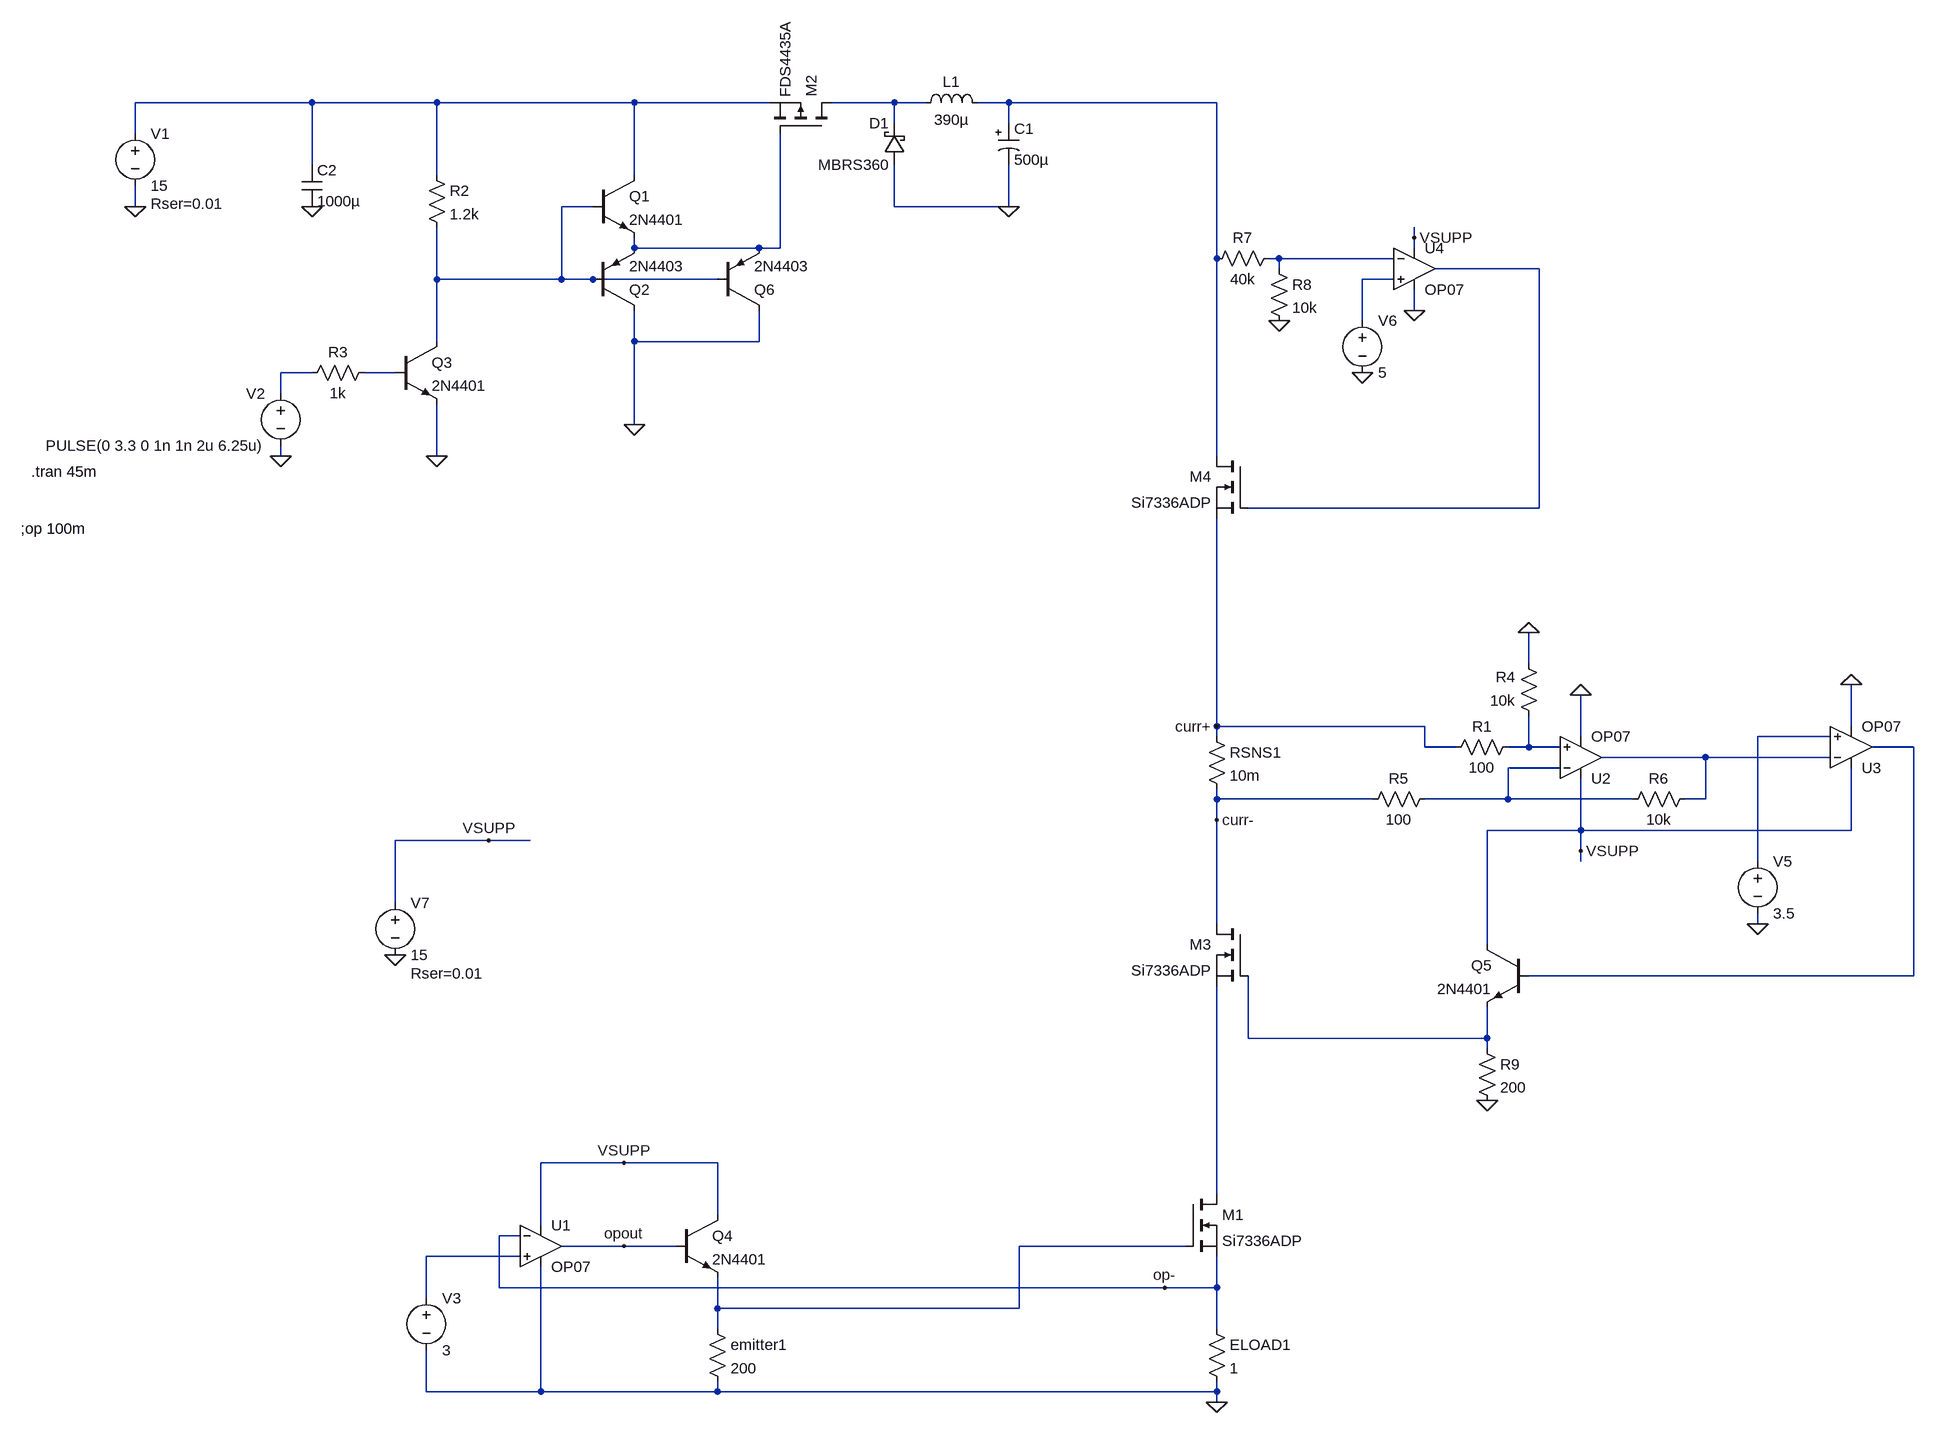
[diagram p0: schematic EloadSimWithBuck.asc]
EloadSimWithBuck.asc, the LTspice schematic file:
Version 4
SHEET 1 1988 2104
WIRE -480 64 -752 64
WIRE -288 64 -480 64
WIRE 16 64 -288 64
WIRE 224 64 16 64
WIRE 416 64 320 64
WIRE 464 64 416 64
WIRE 592 64 544 64
WIRE 912 64 592 64
WIRE 416 96 416 64
WIRE 592 96 592 64
WIRE -752 112 -752 64
WIRE -480 160 -480 64
WIRE -288 176 -288 64
WIRE 16 176 16 64
WIRE -752 224 -752 192
WIRE -48 224 -96 224
WIRE 416 224 416 160
WIRE 592 224 592 160
WIRE 592 224 416 224
WIRE 1216 272 1216 256
WIRE 16 288 16 272
WIRE 208 288 16 288
WIRE 240 288 240 112
WIRE 240 288 208 288
WIRE 1216 288 1216 272
WIRE 912 304 912 64
WIRE 1008 304 992 304
WIRE 1184 304 1008 304
WIRE 1008 320 1008 304
WIRE 1408 320 1248 320
WIRE -288 336 -288 256
WIRE -96 336 -96 224
WIRE -96 336 -288 336
WIRE -48 336 -96 336
WIRE 144 336 -48 336
WIRE 1184 336 1136 336
WIRE 1216 384 1216 352
WIRE 1136 400 1136 336
WIRE -288 432 -288 336
WIRE 16 432 16 384
WIRE 208 432 208 384
WIRE 208 432 16 432
WIRE -480 480 -528 480
WIRE -352 480 -400 480
WIRE -528 512 -528 480
WIRE 16 560 16 432
WIRE -528 608 -528 592
WIRE -288 608 -288 528
WIRE 912 608 912 304
WIRE 1408 688 1408 320
WIRE 1408 688 960 688
WIRE 1392 928 1392 880
WIRE 912 1024 912 704
WIRE 1232 1024 912 1024
WIRE 1888 1024 1888 960
WIRE 912 1040 912 1024
WIRE 1472 1040 1472 976
WIRE 1856 1040 1744 1040
WIRE 1232 1056 1232 1024
WIRE 1280 1056 1232 1056
WIRE 1392 1056 1392 1008
WIRE 1392 1056 1360 1056
WIRE 1440 1056 1392 1056
WIRE 1984 1056 1920 1056
WIRE 1664 1072 1504 1072
WIRE 1856 1072 1664 1072
WIRE 1440 1088 1360 1088
WIRE 912 1136 912 1120
WIRE 1152 1136 912 1136
WIRE 1360 1136 1360 1088
WIRE 1360 1136 1232 1136
WIRE 1552 1136 1360 1136
WIRE 1664 1136 1664 1072
WIRE 1664 1136 1632 1136
WIRE 912 1168 912 1136
WIRE 1472 1184 1472 1104
WIRE 1472 1184 1328 1184
WIRE 1888 1184 1888 1088
WIRE 1888 1184 1472 1184
WIRE -208 1200 -352 1200
WIRE -144 1200 -208 1200
WIRE 1472 1216 1472 1184
WIRE 1472 1232 1472 1216
WIRE 1744 1232 1744 1040
WIRE -352 1296 -352 1200
WIRE 912 1328 912 1168
WIRE 1744 1328 1744 1312
WIRE 1328 1360 1328 1184
WIRE 1984 1408 1984 1056
WIRE 1984 1408 1392 1408
WIRE 960 1504 960 1408
WIRE 1328 1504 1328 1456
WIRE 1328 1504 960 1504
WIRE 1328 1520 1328 1504
WIRE 0 1696 -128 1696
WIRE 144 1696 0 1696
WIRE 912 1744 912 1424
WIRE 144 1776 144 1696
WIRE -128 1792 -128 1696
WIRE -160 1808 -192 1808
WIRE 0 1824 -96 1824
WIRE 80 1824 0 1824
WIRE 864 1824 608 1824
WIRE -160 1840 -304 1840
WIRE -192 1888 -192 1808
WIRE 832 1888 -192 1888
WIRE 912 1888 912 1840
WIRE 912 1888 832 1888
WIRE -304 1904 -304 1840
WIRE 144 1920 144 1872
WIRE 608 1920 608 1824
WIRE 608 1920 144 1920
WIRE 144 1952 144 1920
WIRE 912 1952 912 1888
WIRE -304 2048 -304 1984
WIRE -128 2048 -128 1856
WIRE -128 2048 -304 2048
WIRE 144 2048 144 2032
WIRE 144 2048 -128 2048
WIRE 912 2048 912 2032
WIRE 912 2048 144 2048
WIRE 912 2064 912 2048
FLAG -528 608 0
FLAG -752 224 0
FLAG -288 608 0
FLAG 16 560 0
FLAG 912 2064 0
FLAG 0 1824 opout
FLAG 832 1888 op-
FLAG 912 1024 curr+
FLAG 912 1168 curr-
FLAG 1744 1328 0
FLAG 1392 880 0
FLAG 1472 976 0
FLAG 1888 960 0
FLAG 1008 400 0
FLAG 1216 384 0
FLAG 1136 480 0
FLAG 1328 1600 0
FLAG -352 1376 0
FLAG -208 1200 VSUPP
FLAG 0 1696 VSUPP
FLAG 1472 1216 VSUPP
FLAG 1216 272 VSUPP
FLAG 592 224 0
FLAG -480 224 0
DATAFLAG 1408 608 ""
DATAFLAG 480 1920 ""
DATAFLAG 528 1888 ""
DATAFLAG 784 64 ""
DATAFLAG 912 208 ""
DATAFLAG 912 816 ""
DATAFLAG 1744 1408 ""
DATAFLAG 1120 1520 ""
DATAFLAG 1184 1504 ""
SYMBOL schottky 432 160 R180
WINDOW 0 24 64 Left 2
WINDOW 3 24 0 Left 2
SYMATTR InstName D1
SYMATTR Value MBRS360
SYMATTR Description Diode
SYMATTR Type diode
SYMBOL ind 448 80 R270
WINDOW 0 32 56 VTop 2
WINDOW 3 5 56 VBottom 2
SYMATTR InstName L1
SYMATTR Value 390µ
SYMATTR SpiceLine Rser=72m
SYMBOL voltage -752 96 R0
WINDOW 123 0 0 Left 0
WINDOW 39 24 124 Left 2
SYMATTR SpiceLine Rser=0.01
SYMATTR InstName V1
SYMATTR Value 15
SYMBOL voltage -528 496 M0
WINDOW 123 0 0 Left 0
WINDOW 39 0 0 Left 0
SYMATTR InstName V2
SYMATTR Value PULSE(0 3.3 0 1n 1n 2u 6.25u)
SYMBOL res -304 160 R0
SYMATTR InstName R2
SYMATTR Value 1.2k
SYMBOL res -384 464 R90
WINDOW 0 0 56 VBottom 2
WINDOW 3 32 56 VTop 2
SYMATTR InstName R3
SYMATTR Value 1k
SYMBOL npn -352 432 R0
SYMATTR InstName Q3
SYMATTR Value 2N4401
SYMBOL npn -48 176 R0
SYMATTR InstName Q1
SYMATTR Value 2N4401
SYMBOL pnp -48 384 M180
SYMATTR InstName Q2
SYMATTR Value 2N4403
SYMBOL pmos 320 112 M270
SYMATTR InstName M2
SYMATTR Value FDS4435A
SYMBOL polcap 576 96 R0
SYMATTR InstName C1
SYMATTR Value 500µ
SYMATTR SpiceLine Rser=74m
SYMBOL OpAmps\\OP07 -128 1760 R0
SYMATTR InstName U1
SYMBOL nmos 864 1744 R0
SYMATTR InstName M1
SYMATTR Value Si7336ADP
SYMBOL res 896 1936 R0
SYMATTR InstName ELOAD1
SYMATTR Value 1
SYMBOL voltage -304 1888 R0
WINDOW 123 0 0 Left 0
WINDOW 39 0 0 Left 0
SYMATTR InstName V3
SYMATTR Value 3
SYMBOL res 896 1024 R0
SYMATTR InstName RSNS1
SYMATTR Value 10m
SYMBOL OpAmps\\OP07 1472 1136 M180
SYMATTR InstName U2
SYMBOL res 1376 1040 R90
WINDOW 0 0 56 VBottom 2
WINDOW 3 32 56 VTop 2
SYMATTR InstName R1
SYMATTR Value 100
SYMBOL res 1408 1024 R180
WINDOW 0 36 76 Left 2
WINDOW 3 36 40 Left 2
SYMATTR InstName R4
SYMATTR Value 10k
SYMBOL res 1248 1120 R90
WINDOW 0 0 56 VBottom 2
WINDOW 3 32 56 VTop 2
SYMATTR InstName R5
SYMATTR Value 100
SYMBOL res 1648 1120 R90
WINDOW 0 0 56 VBottom 2
WINDOW 3 32 56 VTop 2
SYMATTR InstName R6
SYMATTR Value 10k
SYMBOL OpAmps\\OP07 1888 1120 M180
SYMATTR InstName U3
SYMBOL voltage 1744 1216 R0
WINDOW 123 0 0 Left 0
WINDOW 39 0 0 Left 0
SYMATTR InstName V5
SYMATTR Value 3.5
SYMBOL nmos 960 1328 M0
SYMATTR InstName M3
SYMATTR Value Si7336ADP
SYMBOL res 1008 288 R90
WINDOW 0 0 56 VBottom 2
WINDOW 3 32 56 VTop 2
SYMATTR InstName R7
SYMATTR Value 40k
SYMBOL res 992 304 R0
SYMATTR InstName R8
SYMATTR Value 10k
SYMBOL OpAmps\\OP07 1216 256 R0
SYMATTR InstName U4
SYMBOL nmos 960 608 M0
SYMATTR InstName M4
SYMATTR Value Si7336ADP
SYMBOL voltage 1136 384 R0
WINDOW 123 0 0 Left 0
WINDOW 39 0 0 Left 0
SYMATTR InstName V6
SYMATTR Value 5
SYMBOL npn 80 1776 R0
SYMATTR InstName Q4
SYMATTR Value 2N4401
SYMBOL res 128 1936 R0
SYMATTR InstName emitter1
SYMATTR Value 200
SYMBOL res 1312 1504 R0
SYMATTR InstName R9
SYMATTR Value 200
SYMBOL npn 1392 1360 M0
SYMATTR InstName Q5
SYMATTR Value 2N4401
SYMBOL voltage -352 1280 R0
WINDOW 123 0 0 Left 0
WINDOW 39 24 124 Left 2
SYMATTR SpiceLine Rser=0.01
SYMATTR InstName V7
SYMATTR Value 15
SYMBOL pnp 144 384 M180
SYMATTR InstName Q6
SYMATTR Value 2N4403
SYMBOL cap -496 160 R0
SYMATTR InstName C2
SYMATTR Value 1000µ
TEXT -912 632 Left 2 !.tran 45m
TEXT -928 720 Left 2 !;op 100m

The netlist it stands for:
* EloadSimWithBuck.asc
D1 0 N002 MBRS360
L1 N002 N003 390µ Rser=72m
V1 N001 0 15 Rser=0.01
V2 N009 0 PULSE(0 3.3 0 1n 1n 2u 6.25u)
R2 N001 N004 1.2k
R3 N010 N009 1k
Q3 N004 N010 0 0 2N4401
Q1 N001 N004 N005 0 2N4401
Q2 0 N004 N005 0 2N4403
M2 N002 N005 N001 N001 FDS4435A
C1 N003 0 500µ Rser=74m
XU1 N019 op- VSUPP 0 opout LT1001  ; OP07, pins In+ In- V+ V- OUT
M1 N017 N018 op- op- Si7336ADP
R§ELOAD1 op- 0 1
V3 N019 0 3
RSNS1 curr+ curr- 10m
XU2 N012 N015 VSUPP 0 N014 LT1001  ; OP07, pins In+ In- V+ V- OUT
R1 N012 curr+ 100
R4 N012 0 10k
R5 N015 curr- 100
R6 N014 N015 10k
XU3 N011 N014 VSUPP 0 N013 LT1001  ; OP07, pins In+ In- V+ V- OUT
V5 N011 0 3.5
M3 curr- N016 N017 N017 Si7336ADP
R7 N006 N003 40k
R8 N006 0 10k
XU4 N008 N006 VSUPP 0 N007 LT1001  ; OP07, pins In+ In- V+ V- OUT
M4 N003 N007 curr+ curr+ Si7336ADP
V6 N008 0 5
Q4 VSUPP opout N018 0 2N4401
R§emitter1 N018 0 200
R9 N016 0 200
Q5 VSUPP N013 N016 0 2N4401
V7 VSUPP 0 15 Rser=0.01
Q6 0 N004 N005 0 2N4403
C2 N001 0 1000µ
.model D D
.lib standard.dio
.model NPN NPN
.model PNP PNP
.lib standard.bjt
.model NMOS NMOS
.model PMOS PMOS
.lib standard.mos
.tran 45m
;op 100m
.lib LTC.lib
.backanno
.end